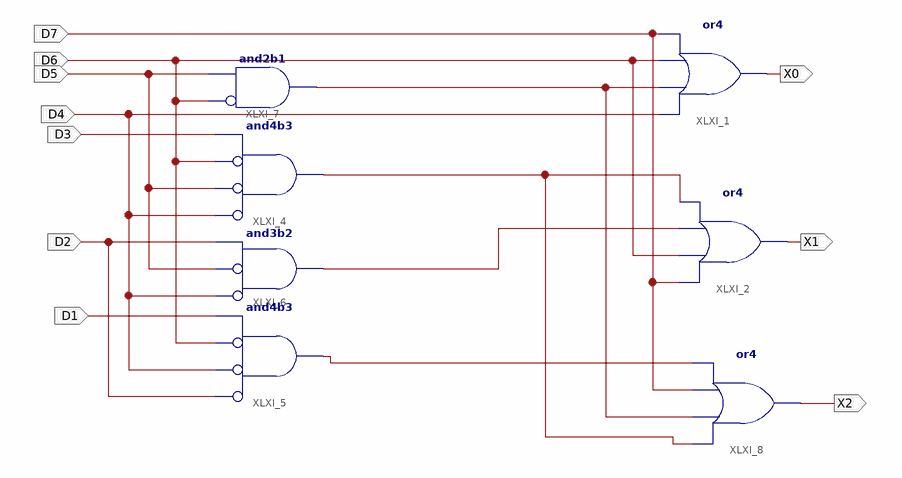
[diagram p0: schematic sheet 1]
// Xilinx ISE schematic Shem.sch (virtex5) as structural Verilog: 7 symbols, 10 ports
module Shem (
  input  D3,
  input  D7,
  input  D1,
  input  D6,
  input  D5,
  input  D4,
  input  D2,
  output X0,
  output X1,
  output X2
);

  wire XLXN_10, XLXN_16, XLXN_37, XLXN_40;

  or XLXI_1 (X0, D4, XLXN_16, D6, D7);
  or XLXI_2 (X1, D7, D6, XLXN_37, XLXN_40);
  and XLXI_4 (XLXN_40, ~D4, ~D5, ~D6, D3);  // and4b3
  and XLXI_5 (XLXN_10, ~D2, ~D4, ~D6, D1);  // and4b3
  and XLXI_6 (XLXN_37, ~D4, ~D5, D2);  // and3b2
  and XLXI_7 (XLXN_16, ~D6, D5);  // and2b1
  or XLXI_8 (X2, XLXN_40, XLXN_16, D7, XLXN_10);
endmodule
